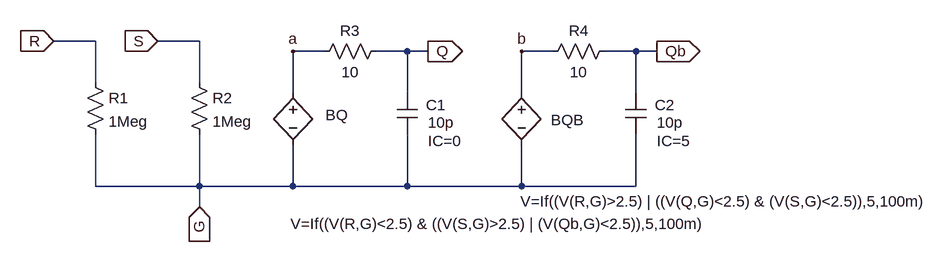
[diagram p0: schematic SR_latch_G.asc]
SR_latch_G.asc, the LTspice schematic file:
Version 4.1
SHEET 1 1168 680
WIRE -192 48 -256 48
WIRE -32 48 -96 48
WIRE 160 64 112 64
WIRE 288 64 240 64
WIRE 320 64 288 64
WIRE 512 64 464 64
WIRE 640 64 592 64
WIRE 672 64 640 64
WIRE -192 112 -192 48
WIRE -32 112 -32 48
WIRE 112 128 112 64
WIRE 288 128 288 64
WIRE 464 128 464 64
WIRE 640 128 640 64
WIRE -192 272 -192 192
WIRE -32 272 -32 192
WIRE -32 272 -192 272
WIRE 112 272 112 208
WIRE 112 272 -32 272
WIRE 288 272 288 192
WIRE 288 272 112 272
WIRE 464 272 464 208
WIRE 464 272 288 272
WIRE 640 272 640 192
WIRE 640 272 464 272
WIRE -32 304 -32 272
FLAG -256 48 R
IOPIN -256 48 In
FLAG -96 48 S
IOPIN -96 48 In
FLAG 320 64 Q
IOPIN 320 64 Out
FLAG 672 64 Qb
IOPIN 672 64 Out
FLAG 112 64 a
FLAG 464 64 b
FLAG -32 304 G
IOPIN -32 304 In
SYMBOL bv 112 112 R0
WINDOW 0 50 50 Left 2
WINDOW 3 -4 218 Left 2
SYMATTR InstName BQ
SYMATTR Value V=If((V(R,G)<2.5) & ((V(S,G)>2.5) | (V(Qb,G)<2.5)),5,100m)
SYMBOL res -208 96 R0
SYMATTR InstName R1
SYMATTR Value 1Meg
SYMBOL res -48 96 R0
SYMATTR InstName R2
SYMATTR Value 1Meg
SYMBOL res 256 48 R90
WINDOW 0 0 56 VBottom 2
WINDOW 3 32 56 VTop 2
SYMATTR InstName R3
SYMATTR Value 10
SYMBOL cap 272 128 R0
WINDOW 0 45 19 Left 2
WINDOW 3 48 46 Left 2
WINDOW 123 48 74 Left 2
SYMATTR InstName C1
SYMATTR Value 10p
SYMATTR Value2 IC=0
SYMBOL bv 464 112 R0
WINDOW 0 45 58 Left 2
WINDOW 3 -2 183 Left 2
SYMATTR InstName BQB
SYMATTR Value V=If((V(R,G)>2.5) | ((V(Q,G)<2.5) & (V(S,G)<2.5)),5,100m)
SYMBOL res 608 48 R90
WINDOW 0 0 56 VBottom 2
WINDOW 3 32 56 VTop 2
SYMATTR InstName R4
SYMATTR Value 10
SYMBOL cap 624 128 R0
WINDOW 0 45 19 Left 2
WINDOW 3 48 46 Left 2
WINDOW 123 48 74 Left 2
SYMATTR InstName C2
SYMATTR Value 10p
SYMATTR Value2 IC=5

The netlist it stands for:
* SR_latch_G.asc
BQ a G V=If((V(R,G)<2.5) & ((V(S,G)>2.5) | (V(Qb,G)<2.5)),5,100m)
R1 R G 1Meg
R2 S G 1Meg
R3 Q a 10
C1 Q G 10p IC=0
BQB b G V=If((V(R,G)>2.5) | ((V(Q,G)<2.5) & (V(S,G)<2.5)),5,100m)
R4 Qb b 10
C2 Qb G 10p IC=5
.backanno
.end